# Altium schematic sheet Connections.SchDoc
size A
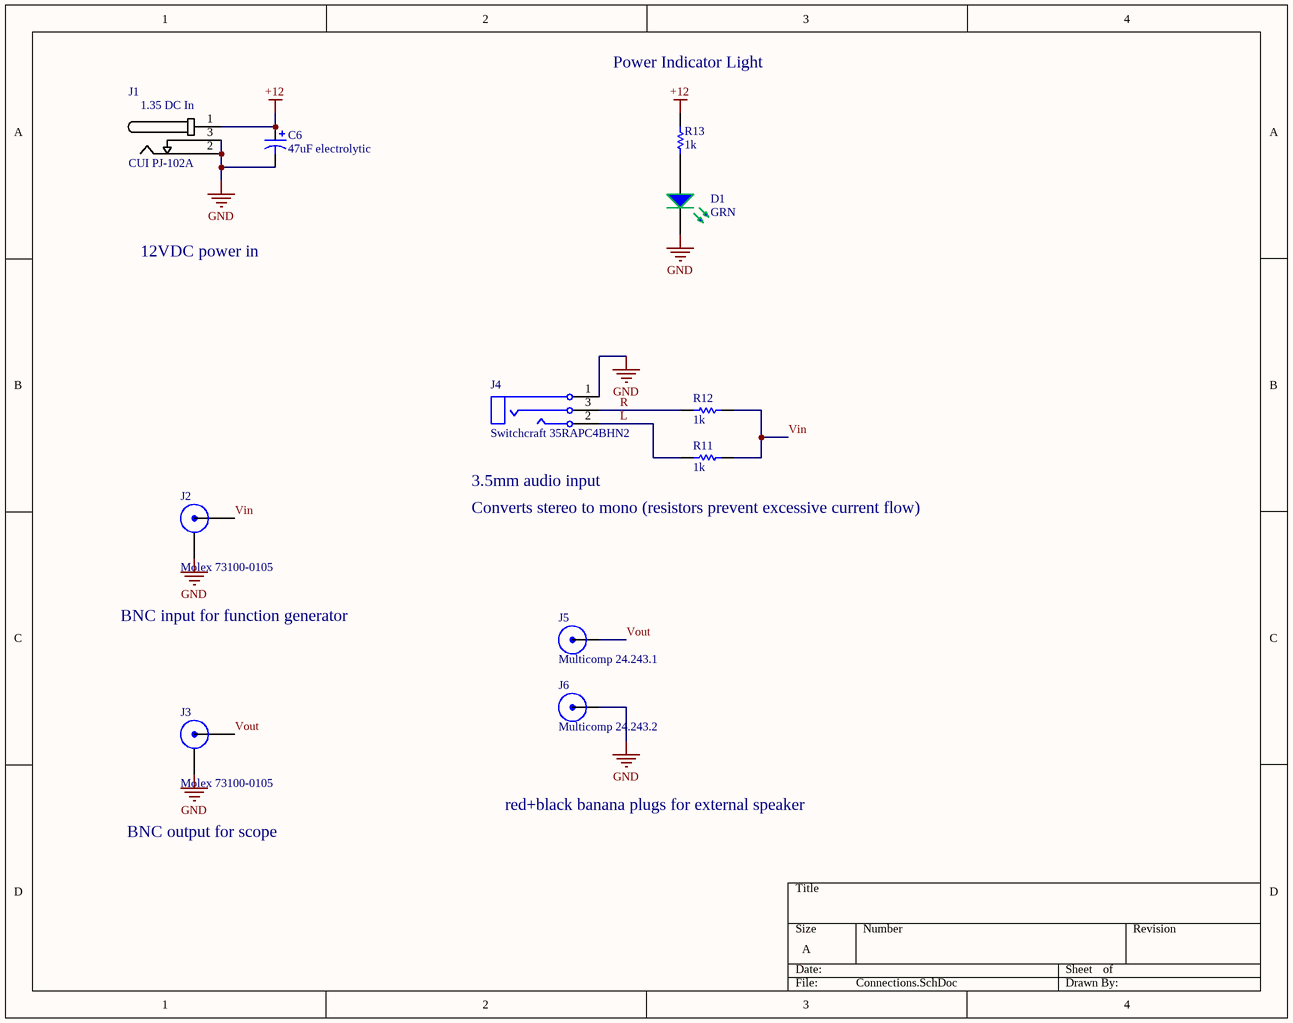
[diagram p0: Connections.SchDoc]

## Parts
C6  47uF electrolytic  [PCB-bs2nfpedd8vjo8odb39w-1]
D1  GRN  [PCBComponent_1]
J1  CUI PJ-102A  [PCBComponent_1 - duplicate]
J2  Molex 73100-0105  [PCB-581953-1]
J3  Molex 73100-0105  [PCB-581953-1]
J4  Switchcraft 35RAPC4BHN2  [PCB-329508-1]
J5  Multicomp 24.243.1  [PCB-1keg917tfggg2k36z9zw-1]
J6  Multicomp 24.243.2  [PCB-20399855-1]
R11  1k  [PCB-ufx52wqpb97u1085hkka-1]
R12  1k  [PCB-ufx52wqpb97u1085hkka-1]
R13  1k  [PCB-ufx52wqpb97u1085hkka-1]

## Nets
+12: C6.1 J1.1 R13.2
GND: C6.2 D1.2(K) J1.2 J1.3 J2.2 J3.2 J4.1(SLEEVE) J6.1
L: J4.2(TIP) R11.2
R: J4.3(RING) R12.2
Vin: J2.1 R11.1 R12.1
Vout: J3.1 J5.1
NetD1_1: D1.1(A) R13.1

## Notes on the sheet
- Power Indicator Light
- 12VDC power in
- (near J4) 3.5mm audio input
- (near R11) Converts stereo to mono (resistors prevent excessive current flow)
- BNC input for function generator
- BNC output for scope
- red+black banana plugs for external speaker
- (in symbol 1352) 1.35 DC In

## Library data of the parts
C6 = EEU-FC1H470: Cap Aluminum Lytic 47uF 50V 20% (6.3 X 11.2mm) Radial 2.5mm 260mA 1000h 105C Automotive Bulk; Capacitance: 47.0 F; Dielectric Material: Aluminum Electrolytic; Voltage Rating (DC): 50.0 V; Lead-Free Status: Lead Free; Mounting Style: Through Hole; Lifecycle Status: Not Listed by Manufacturer; Manufacturer Part Number: EEU-FC1H470; Packaging: Bulk; Capacitance Tolerance: ±20%; Number of Pins: 2; OctopartID: 6ed4a5842ea2b113; Size-Length: 11.2 mm; RoHS: Compliant; REACH SVHC Compliance: No SVHC; Size-Diameter: 6.30 mm; Octopart URL: http://octopart.com/eeu-fc1h470-panasonic-39478544; Size-Height: 11.2 mm
D1 = XVB1LUG50D: 5mm Lens, One Position CBI ; Emitting Color Green with Green Diffused Lens; Datasheet: https://www.sunledusa.com/products/spec/XVB1LUG50D.pdf; Color: Green; Manufacturer Part Number: XVB1LUG50D
J1 = 1352: FolioGadgets DC Jack; Manufacturer Part Number: B06XQ2JGQQ; OctopartID: 2700effd37adf8c7
J2 J3 = 73100-0105: 50 Ohms, BNC Right-Angle PCB Jack Receptacle, Nickel Plated Zinc Alloy Body, Low Profile; Gender: Female; RoHS: Compliant; Contact Material: Phosphor Bronze; Lifecycle Status: Active; Halogen Free Status: Not Reviewed; Orientation: Right Angle; Manufacturer Part Number: 73100-0105; OctopartID: fb98329907f8245f
J4 = 35RAPC4BHN2: CONN JACK STEREO 3.5MM HORIZON; Lead-Free Status: Lead Free; Cable Length: 0.014 m; Number of Contacts: 3; Gender: Male; Contact Plating: Silver; OctopartID: 0ad0c3daa371d517; Octopart Url: https://octopart.com/35rapc4bhn2-switchcraft-36039; REACH SVHC Compliance: No SVHC; RoHS: Compliant; Number of Positions: 3; Color: Black; Manufacturer Part Number: 35RAPC4BHN2
J5 = 24.243.1: Banana Test Connector, 4mm, Jack, PCB Mount, 20 A, 30 V, Silver Plated Contacts, Red; Current Rating: 20.0 A; Voltage Rating (DC): 30.0 V; Gender: Male; RoHS: Compliant; Octopart Url: https://octopart.com/24.243.1-multicomp-57101049; Contact Plating: Silver; OctopartID: 7431be5c1baeabf6; Contact Material: Brass; Manufacturer Part Number: 24.243.1; Size-Length: 0.024 m; REACH SVHC Compliance: No SVHC
J6 = 24.243.2: Banana Test Connector, 4mm, Jack, PCB Mount, 20 A, 30 V, Silver Plated Contacts, Black; Current Rating: 20.0 A; Gender: Male; Manufacturer Part Number: 24.243.2; Contact Plating: Silver; Contact Material: Brass; RoHS: Compliant; Octopart Url: https://octopart.com/24.243.2-multicomp-57101050; Size-Length: 0.024 m; OctopartID: d81d1270b78107da; REACH SVHC Compliance: No SVHC
R11-R13 = CFR50J10K: Through Hole Carbon Film Resistor, CFR Series, 10 kohm, 500 mW, - 5%, 350 V, Axial Leaded